# Altium schematic sheet Sheet3.SchDoc
size A4
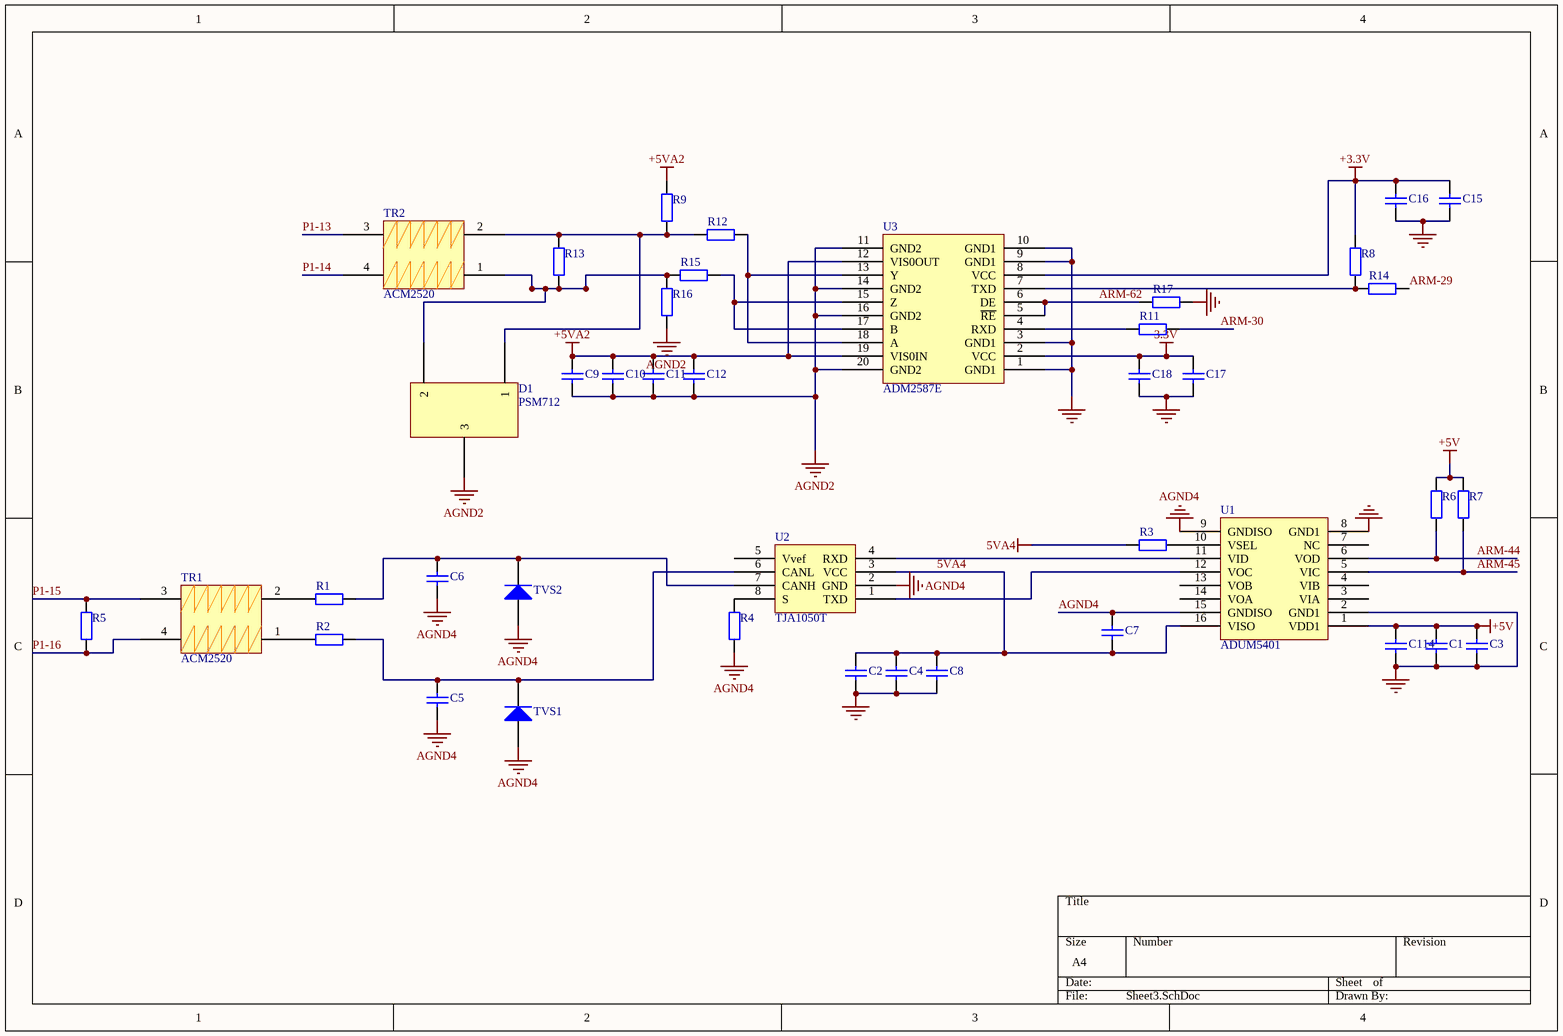
[diagram p0: Sheet3.SchDoc]

## Parts
C1  Cap  [RAD-0.3]  (value not drawn)
C2  Cap  [RAD-0.3]  (value not drawn)
C3  Cap  [RAD-0.3]  (value not drawn)
C4  Cap  [RAD-0.3]  (value not drawn)
C5  Cap  [RAD-0.3]  (value not drawn)
C6  Cap  [RAD-0.3]  (value not drawn)
C7  Cap  [RAD-0.3]  (value not drawn)
C8  Cap  [RAD-0.3]  (value not drawn)
C9  Cap  [RAD-0.3]  (value not drawn)
C10  Cap  [RAD-0.3]  (value not drawn)
C11  Cap  [RAD-0.3]  (value not drawn)
C12  Cap  [RAD-0.3]  (value not drawn)
C15  Cap  [RAD-0.3]  (value not drawn)
C16  Cap  [RAD-0.3]  (value not drawn)
C17  Cap  [RAD-0.3]  (value not drawn)
C18  Cap  [RAD-0.3]  (value not drawn)
C114  Cap  [RAD-0.3]  (value not drawn)
D1  PSM712
R1  Res2  [AXIAL-0.4]  (value not drawn)
R2  Res2  [AXIAL-0.4]  (value not drawn)
R3  Res2  [AXIAL-0.4]  (value not drawn)
R4  Res2  [AXIAL-0.4]  (value not drawn)
R5  Res2  [AXIAL-0.4]  (value not drawn)
R6  Res2  [AXIAL-0.4]  (value not drawn)
R7  Res2  [AXIAL-0.4]  (value not drawn)
R8  Res2  [AXIAL-0.4]  (value not drawn)
R9  Res2  [AXIAL-0.4]  (value not drawn)
R11  Res2  [AXIAL-0.4]  (value not drawn)
R12  Res2  [AXIAL-0.4]  (value not drawn)
R13  Res2  [AXIAL-0.4]  (value not drawn)
R14  Res2  [AXIAL-0.4]  (value not drawn)
R15  Res2  [AXIAL-0.4]  (value not drawn)
R16  Res2  [AXIAL-0.4]  (value not drawn)
R17  Res2  [AXIAL-0.4]  (value not drawn)
TR1  ACM2520
TR2  ACM2520
TVS1  Diode 1N4007  [DO-41]  (value not drawn)
TVS2  Diode 1N4007  [DO-41]  (value not drawn)
U1  ADUM5401
U2  TJA1050T
U3  ADM2587E

## Nets
3.3V: C17.2 C18.2 U3.2(VCC)
5VA4: C2.2 C4.2 C7.1 C8.2 R3.1 U1.16(VISO) U2.3(VCC)
+3.3V: C15.2 C16.2 R8.1 U3.8(VCC)
+5V: C1.2 C3.2 C114.2 R6.2 R7.2 U1.1(VDD1)
+5VA2: C9.2 C10.2 C11.2 C12.2 R9.2 U3.12(VIS0OUT) U3.19(VIS0IN)
AGND2: C9.1 C10.1 C11.1 C12.1 D1.3 R16.1 U3.11(GND2) U3.14(GND2) U3.16(GND2) U3.20(GND2)
AGND4: C5.1 C6.1 C7.2 R4.2 TVS1.1(A) TVS2.1(A) U1.9(GNDISO) U1.15(GNDISO) U2.2(GND)
GND: C1.1 C2.1 C3.1 C4.1 C8.1 C15.1 C16.1 C17.1 C18.1 C114.1 R17.1 U1.2(GND1) U1.8(GND1) U3.1(GND1) U3.3(GND1) U3.9(GND1) U3.10(GND1)
ARM-29: R14.2
ARM-30: R11.1
ARM-44: R6.1 U1.6(VOD)
ARM-45: R7.1 U1.5(VIC)
ARM-62: R17.2 U3.5(~{RE}) U3.6(DE)
P1-13: TR2.3
P1-14: TR2.4
P1-15: R5.2 TR1.3
P1-16: R5.1 TR1.4
NetC5_2: C5.2 R2.1 TVS1.2(K) U2.6(CANL)
NetC6_2: C6.2 R1.1 TVS2.2(K) U2.7(CANH)
NetD1_0: D1.0(2) R13.1 R15.2 R16.2 TR2.1
NetD1_1: D1.1 R9.1 R12.2 R13.2 TR2.2
NetR1_2: R1.2 TR1.2
NetR2_2: R2.2 TR1.1
NetR3_2: R3.2 U1.10(VSEL)
NetR4_1: R4.1 U2.8(S)
NetR8_2: R8.2 R14.1 U3.7(TXD)
NetR11_2: R11.2 U3.4(RXD)
NetR12_1: R12.1 U3.13(Y) U3.18(A)
NetR15_1: R15.1 U3.15(Z) U3.17(B)
NetU1_11: U1.11(VID) U2.4(RXD)
NetU1_12: U1.12(VOC) U2.1(TXD)

Not connected (* = marked no-connect by the designer): U1 3(VIA) 4(VIB) 7(NC) 13(VOB) 14(VOA); U2 5(Vvef)

## Library data of the parts
C1-C12 C15-C18 C114 = Cap: Capacitor; Value: 100pF; Published: 8-Jun-2000; LatestRevisionDate: 17-Jul-2002; LatestRevisionNote: Re-released for DXP Platform.; PackageReference: RAD-0.3; Publisher: Altium Limited
D1 TR1 TR2 U1-U3 = Component_1
R1-R9 R11-R17 = Res2: Resistor; Value: 1K; Published: 8-Jun-2000; LatestRevisionDate: 17-Jul-2002; LatestRevisionNote: Re-released for DXP Platform.; PackageReference: AXIAL-0.4; Publisher: Altium Limited
TVS1 TVS2 = Diode 1N4007: 1 Amp General Purpose Rectifier; Published: 8-Jun-2000; LatestRevisionDate: 17-Jul-2002; LatestRevisionNote: Re-released for DXP Platform.; DatasheetDocument: 1998; PackageDocument: Aug-1999; PackageReference: DO-41; Publisher: Altium Limited; Code_JEDEC: DO-204-AL; ComponentLink1Description: Manufacturer Link; ComponentLink1URL: http://www.fairchildsemi.com/; ComponentLink2Description: Datasheet; ComponentLink2URL: http://www.fairchildsemi.com/ds/1N%2F1N4001.pdf